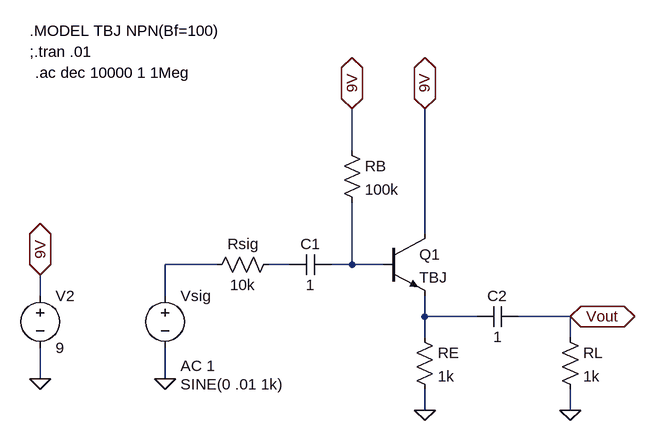
[diagram p0: schematic TBJ - Coletor Comum.asc]
TBJ - Coletor Comum.asc, the LTspice schematic file:
Version 4
SHEET 1 880 680
WIRE 224 192 224 128
WIRE 336 320 336 128
WIRE 16 368 -64 368
WIRE 128 368 96 368
WIRE 224 368 224 272
WIRE 224 368 192 368
WIRE 272 368 224 368
WIRE -256 416 -256 384
WIRE -64 416 -64 368
WIRE 336 448 336 416
WIRE 416 448 336 448
WIRE 560 448 480 448
WIRE 336 480 336 448
WIRE 560 480 560 448
WIRE -256 544 -256 496
WIRE -64 544 -64 496
WIRE 336 592 336 560
WIRE 560 592 560 560
FLAG 224 128 9V
IOPIN 224 128 BiDir
FLAG -64 544 0
FLAG -256 544 0
FLAG -256 384 9V
IOPIN -256 384 BiDir
FLAG 560 448 Vout
IOPIN 560 448 BiDir
FLAG 336 128 9V
IOPIN 336 128 BiDir
FLAG 336 592 0
FLAG 560 592 0
SYMBOL voltage -64 400 R0
WINDOW 3 24 152 Left 2
WINDOW 123 24 124 Left 2
WINDOW 39 0 0 Left 0
SYMATTR Value SINE(0 .01 1k)
SYMATTR Value2 AC 1
SYMATTR InstName Vsig
SYMBOL npn 272 320 R0
SYMATTR InstName Q1
SYMATTR Value TBJ
SYMBOL cap 128 384 R270
WINDOW 0 32 32 VTop 2
WINDOW 3 0 32 VBottom 2
SYMATTR InstName C1
SYMATTR Value 1
SYMBOL voltage -256 400 R0
WINDOW 123 0 0 Left 0
WINDOW 39 0 0 Left 0
SYMATTR InstName V2
SYMATTR Value 9
SYMBOL res 0 384 R270
WINDOW 0 32 56 VTop 2
WINDOW 3 0 56 VBottom 2
SYMATTR InstName Rsig
SYMATTR Value 10k
SYMBOL res 208 176 R0
SYMATTR InstName RB
SYMATTR Value 100k
SYMBOL res 320 464 R0
SYMATTR InstName RE
SYMATTR Value 1k
SYMBOL res 544 464 R0
SYMATTR InstName RL
SYMATTR Value 1k
SYMBOL cap 416 464 R270
WINDOW 0 32 32 VTop 2
WINDOW 3 0 32 VBottom 2
SYMATTR InstName C2
SYMATTR Value 1
TEXT -272 8 Left 2 !.MODEL TBJ NPN(Bf=100)
TEXT -272 40 Left 2 !;.tran .01
TEXT -264 72 Left 2 !.ac dec 10000 1 1Meg

The netlist it stands for:
* TBJ - Coletor Comum.asc
Vsig N001 0 SINE(0 .01 1k) AC 1
Q1 9V N003 N004 0 TBJ
C1 N002 N003 1
V2 9V 0 9
Rsig N001 N002 10k
RB 9V N003 100k
RE N004 0 1k
RL Vout 0 1k
C2 N004 Vout 1
.model NPN NPN
.model PNP PNP
.lib standard.bjt
.MODEL TBJ NPN(Bf=100)
;.tran .01
.ac dec 10000 1 1Meg
.backanno
.end